# Altium project ESP32_EGG_INCUBATION.PrjPcb
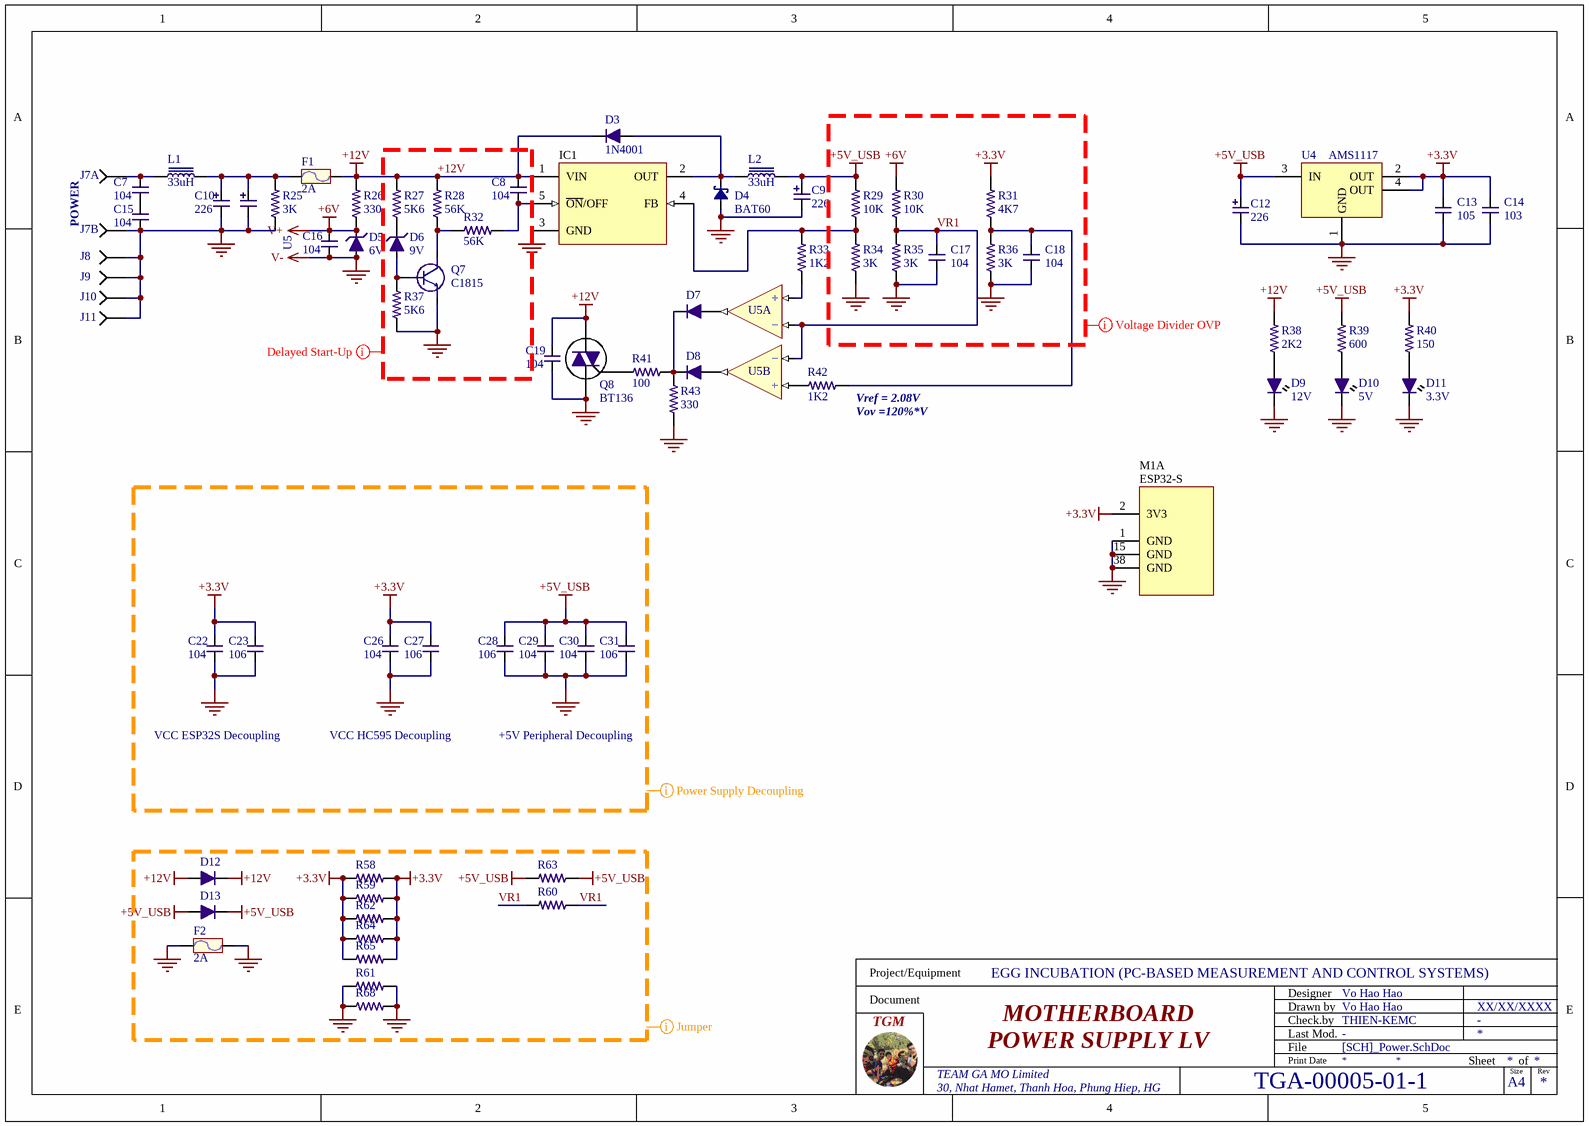
[diagram p0: [SCH]_Power.SchDoc]
4 sheets, 151 parts. Net scope: flat (ports and power ports of the same name join across sheets).
Board file: [PCB]_MotherBoard.PcbDoc
Sheets:
  [SCH]_Power.SchDoc
  [SCH]_MainProcessor.SchDoc
  [SCH]_IO.SchDoc
  [SCH]_HMI.SchDoc

## Sheet [SCH]_Power.SchDoc: MOTHERBOARD
size 297 x 209 mm; CheckedBy: THIEN-KEMC; CompanyName: TEAM GA MO; DrawnBy: Vo Hao Hao; Organization: TEAM GA MO; Address1: TEAM GA MO Limited; Address2: 30, Nhat Hamet, Thanh Hoa, Phung Hiep, HG; TGM_Number: TGA-00005-01-1; Projet: EGG INCUBATION (PC-BASED MEASUREMENT AND CONTROL SYSTEMS); ModifiedBy: -; CreateDate: XX/XX/XXXX; CheckedDate: -; Title2: POWER SUPPLY LV; DivGrp: TGM; Designer: Vo Hao Hao

### Parts
C7  104  [CAP-SMD-0805]
C8  104  [CAP-SMD-0805]
C9  226  [CAP-SMD-2512]
C10  226  [CAP-SMD-2512]
C11  226  [CAP-SMD-2512]  (value not drawn)
C12  226  [CAP-SMD-2512]
C13  105  [CAP-SMD-0805]
C14  103  [CAP-SMD-0805]
C15  104  [CAP-SMD-0805]
C16  104  [CAP-SMD-0805]
C17  104  [CAP-SMD-0805]
C18  104  [CAP-SMD-0805]
C19  104  [CAP-SMD-0805]
C22  104  [CAP-SMD-0805]
C23  106  [CAP-SMD-0805]
C26  104  [CAP-SMD-0805]
C27  106  [CAP-SMD-0805]
C28  106  [CAP-SMD-0805]
C29  104  [CAP-SMD-0805]
C30  104  [CAP-SMD-0805]
C31  106  [CAP-SMD-0805]
D3  1N4001  [DIO-SMD-123]
D4  BAT60  [DIO-SMD-106]
D5  6V  [DIO-SMD-123]
D6  9V  [DIO-SMD-123]
D7  1N4001  [DIO-SMD-123]  (value not drawn)
D8  1N4001  [DIO-SMD-123]  (value not drawn)
D9  12V  [LED0603-IPC]
D10  5V  [LED0603-IPC]
D11  3.3V  [LED0603-IPC]
D12  1N4001  [DIO-SMD-123]  (value not drawn)
D13  1N4001  [DIO-SMD-123]  (value not drawn)
F1  2A  [Fuse-SMD 1813]
F2  2A  [Fuse-SMD 1813]
IC1  LM2596  [TO263]  (value not drawn)
J7  POWER  [KF2/5.08]  (value not drawn)  (parts A,B of 2)
J8  MASS 3MM  [MY_PAD_3MM]  (value not drawn)
J9  MASS 3MM  [MY_PAD_3MM]  (value not drawn)
J10  MASS 3MM  [MY_PAD_3MM]  (value not drawn)
J11  MASS 3MM  [MY_PAD_3MM]  (value not drawn)
L1  33uH  [5026_INDUCTOR]
L2  33uH  [5026_INDUCTOR]
M1  ESP32-S  [ESP32-S-Footprint]  (part A of 4)
Q7  C1815  [SOT23(123)]
Q8  BT136  [TO252AA]
R25  value 3K  [RES-SMD-0805]  (hidden comment: R0805)
R26  value 330  [RES-SMD-0805]  (hidden comment: R0805)
R27  value 5K6  [RES-SMD-0805]  (hidden comment: R0805)
R28  value 56K  [RES-SMD-0805]  (hidden comment: R0805)
R29  value 10K  [RES-SMD-0805]  (hidden comment: R0805)
R30  value 10K  [RES-SMD-0805]  (hidden comment: R0805)
R31  value 4K7  [RES-SMD-0805]  (hidden comment: R0805)
R32  value 56K  [RES-SMD-0805]  (hidden comment: R0805)
R33  value 1K2  [RES-SMD-0805]  (hidden comment: R0805)
R34  value 3K  [RES-SMD-0805]  (hidden comment: R0805)
R35  value 3K  [RES-SMD-0805]  (hidden comment: R0805)
R36  value 3K  [RES-SMD-0805]  (hidden comment: R0805)
R37  value 5K6  [RES-SMD-0805]  (hidden comment: R0805)
R38  value 2K2  [RES-SMD-0805]  (hidden comment: R0805)
R39  value 600  [RES-SMD-0805]  (hidden comment: R0805)
R40  value 150  [RES-SMD-0805]  (hidden comment: R0805)
R41  value 100  [RES-SMD-0805]  (hidden comment: R0805)
R42  value 1K2  [RES-SMD-0805]  (hidden comment: R0805)
R43  value 330  [RES-SMD-0805]  (hidden comment: R0805)
R58  R0805  [RES-SMD-0805]  (value not drawn)
R59  R0805  [RES-SMD-0805]  (value not drawn)
R60  R0805  [RES-SMD-0805]  (value not drawn)
R61  R0805  [RES-SMD-0805]  (value not drawn)
R62  R0805  [RES-SMD-2512]  (value not drawn)
R63  R0805  [RES-SMD-2512]  (value not drawn)
R64  R0805  [RES-SMD-2512]  (value not drawn)
R65  R0805  [RES-SMD-2512]  (value not drawn)
R68  R0805  [RES-SMD-0805]  (value not drawn)
U4  AMS1117  [SOT223(1234)]
U5  LM358  [SOIC-8S]  (value not drawn)  (parts A,B of 2)

### Nets
+3.3V: C13.2 C14.2 C22.2 C23.2 C26.2 C27.2 M1.2(3V3) R31.2 R40.2 R58.1 R58.2 R59.1 R59.2 R62.1 R62.2 R64.1 R64.2 R65.1 R65.2 U4.2(OUT) U4.4(OUT)
+5V_USB: C9.1 C12.1 C28.2 C29.2 C30.2 C31.2 D13.1 D13.2 L2.2 R29.2 R39.2 R63.1 R63.2 U4.3(IN)
+6V: C16.2 D5.2 R26.1 R30.2 U5.8(V+)  [also labelled V+]
+12V: C8.2 C19.2 D3.2 D12.1 D12.2 F1.2 IC1.1(VIN) Q8.2(T2) R26.2 R27.2 R28.2 R38.2
GND: C9.2 C10.2 C11.2 C12.2 C13.1 C14.1 C15.1 C16.1 C17.1 C18.1 C19.1 C22.1 C23.1 C26.1 C27.1 C28.1 C29.1 C30.1 C31.1 D4.1 D5.1 D9.K D10.K D11.K F2.1 F2.2 IC1.3(GND) J7.2 J8.0 J9.0 J10.0 J11.0 M1.1(GND) M1.15(GND) M1.38(GND) Q7.3(E) Q8.1(T1) R25.1 R34.1 R35.1 R36.1 R37.1 R43.1 R61.1 R61.2 R68.1 R68.2 U4.1(GND) U5.4(V-)  [also labelled V-]
VR1: C17.2 R30.1 R35.2 R60.1 R60.2 U5.2(-IN) U5.6(-IN)
NetC7_1: C7.1 C15.2
NetC7_2: C7.2 J7.1 L1.1
NetC8_1: C8.1 IC1.5(~{ON}/OFF) R32.1
NetC10_1: C10.1 C11.1 F1.1 L1.2 R25.2
NetC18_2: C18.2 R31.1 R36.2 R42.1
NetD3_1: D3.1 D4.2 IC1.2(OUT) L2.1
NetD6_1: D6.1 Q7.1(B) R37.2
NetD6_2: D6.2 R27.1
NetD7_1: D7.1 U5.1(OUT)
NetD7_2: D7.2 D8.2 R41.2 R43.2
NetD8_1: D8.1 U5.7(OUT)
NetD9_A: D9.A R38.1
NetD10_A: D10.A R39.1
NetD11_A: D11.A R40.1
NetIC1_4: IC1.4(FB) R29.1 R33.2 R34.2
NetQ7_2: Q7.2(C) R28.1 R32.2
NetQ8_3: Q8.3(G) R41.1
NetR33_1: R33.1 U5.3(+IN)
NetR42_2: R42.2 U5.5(+IN)

### Layout directives
mark named Delayed Start-Up: +12V, GND
mark named Voltage Divider OVP: +3.3V, +5V_USB, +6V, GND, VR1
mark named Power Supply Decoupling: +3.3V, +5V_USB, GND
mark named Jumper: +3.3V, +5V_USB, +12V, GND, VR1

### Notes on the sheet
- (near J7) POWER
- U5
- (near R42) Vref = 2.08V
- (near R42) Vov =120%*V
- VCC ESP32S Decoupling
- VCC HC595 Decoupling
- +5V Peripheral Decoupling
- Project/Equipment
- Document
- Designer
- Drawn by
- Check.by
- File
- Last Mod.
- Print Date
- Sheet
- Size
- A4
- of
- Rev

### Library data of the parts
C7 C8 C13-C19 C22 C23 C26-C31 = Cap-Non-SMD: Non-polar capacitor
C9-C12 = Cap-Pol-SMD: Non-polar capacitor
D3 D7 D8 D12 D13 = 1N4001: 1.0A RECTIFIER; ComponentLink1Description: Datasheet; ComponentLink1URL: E:\NEW_DATA\ELECTRONIC_DOCUMENT\DATASHEET\1N4001 (2).pdf; Price: 0.006
D4 = BAT60: DIODE SCHOTTKY 10V 3A SOD323-2; Supplier 1: Digi-Key; Supplier Part Number 1: BAT60BE6327HTSA1CT-ND; Price: 0.008
D5 D6 = ZENER: DIODE-ZNR 5.1V 5% PD=1W IR=10uA; Manufacturer: Littlefuse Inc.; Manufacturer’s ordering code: SMF22A; Value: 24.4V; Part Number: SMF22A; Supplier 1: Digi-Key; Supplier 2: Mouser; Supplier Part Number 1: F5822CT-ND; Supplier Part Number 2: 576-SMF22A; Supplier 3: LCSC; Supplier Part Number 3: C169431
D9 = LED 0603 Red: LED RED CLEAR 0603 SMD VF 1.8; Supplier 1: Digi-Key; Supplier Part Number 1: 732-4979-1-ND
D10 = LED 0603 Yellow: LED YELLOW CLEAR 0603 SMD VF 1.85; Supplier 1: Digi-Key; Supplier Part Number 1: 732-4981-1-ND
D11 = LED 0603 Green: LED GREEN CLEAR 0603 SMD VF 2.5V; Supplier 1: Digi-Key; Supplier Part Number 1: 732-4971-1-ND
F1 F2 = Fuse SMD
IC1 = LM2596: Power IC; Max Input Voltage: 12 V; Max Output Current: 3 (6.0 peak) A; Max Output Voltage: mV; Category: IC-Power; Min Input Voltage: mV; Min Output Voltage: mV; Mounting Technology: Surface Mount; Status: Unreleased; Supply Voltage: mV; Temperature Range: -40 to +125 degC
J7 = JP2_IN
J8-J11 = JP1_IN: 3MM PAD
L1 L2 = INDUCTOR_FE: 2.2µH Shielded Wirewound Inductor 8.2A 10mOhm Max Nonstandard, 4 Lead; Supplier 1: Digi-Key; Supplier 2: Mouser; Supplier Part Number 1: 811-3603-1-ND; Supplier Part Number 2: 580-482R2SC; Value: 33uH
M1 = ESP32-S: Tensilica Xtensa LX6 microprocessor @ 160 or 240 MHz · 320 KiB SRAM; Bandwidth: 72 MHz; Data Rate: 150 Mbps; Interface: Ethernet, I2C, I2S, SPI, UART; Supply Voltage: 2.7 ~ 3.6 V; Number of ADC Channels: 16; Number of GPIO: 32; Nominal Supply Current: 500 mA; Number of cores: 2; Max CPU Freq: 240 MHz; CPU Name: ESP32-D0WDQ6; ComponentLink1Description: PCB; ComponentLink1URL: https://evertdekker.com/wp/?p=854; Temperature Range: -40 to +85 degC; Height: 3.2 mm
Q7 = NPN: Transistor, NPN, RF, 50mA, 12V; Supplier 1: Digi-Key; Supplier Part Number 1: 568-11514-1-ND
Q8 = SCR: THYRISTOR-TRIAC TO-220AB VRRM=600
R25-R43 = RES: Chip Resistor, 0805, 1%, 1/8 W; Supplier Part Number 1: 311-1.00KLRCT-ND; PackageReference: J1-0805; PackageDescription: Chip Resistor; Price: 0.005
R58-R61 R68 = RES: Chip Resistor, 0805, 1%, 1/8 W; Value: 0; Supplier Part Number 1: 311-1.00KLRCT-ND; PackageReference: J1-0805; PackageDescription: Chip Resistor; Price: 0.005
R62-R65 = RES: Chip Resistor, 0805, 1%, 1/8 W; Value: 1.0; Supplier Part Number 1: 311-1.00KLRCT-ND; PackageReference: J1-0805; PackageDescription: Chip Resistor; Price: 0.005
U4 = AMS1117: 1A Bipolar Linear Regulator; ComponentLink1Description: Datasheet; ComponentLink1URL: E:\NEW_DATA\ELECTRONIC_DOCUMENT\DATASHEET\AMS1117-1-2_C475600.pdf
U5 = LM358: 7mV 250nA 7uV/C 1MHz 0.6V/uS 0.8mA 3-32V; Price: 0.24

## Sheet [SCH]_MainProcessor.SchDoc: MOTHERBOARD
size 297 x 209 mm; CheckedBy: THIEN-KEMC; CompanyName: TEAM GA MO; DrawnBy: Vo Hao Hao; Organization: TEAM GA MO; Address1: TEAM GA MO Limited; Address2: 30, Nhat Hamet, Thanh Hoa, Phung Hiep, HG; TGM_Number: TGA-00005-02-1; Projet: EGG INCUBATION (PC-BASED MEASUREMENT AND CONTROL SYSTEMS); ModifiedBy: -; CreateDate: XX/XX/XXXX; CheckedDate: -; Title2: MAIN PROCESSOR ESP32; DivGrp: TGM; Designer: Vo Hao Hao
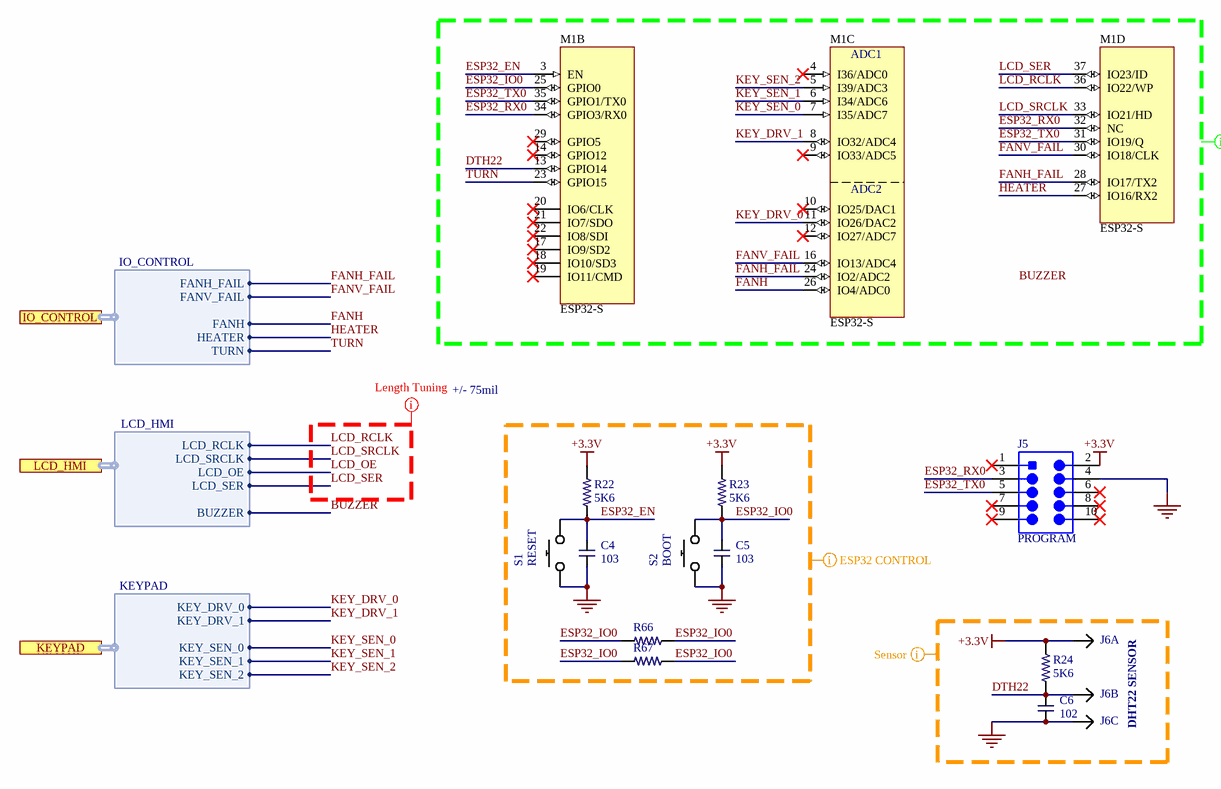
[diagram p1: [SCH]_MainProcessor.SchDoc]

### Parts
C4  103  [CAP-SMD-0805]
C5  103  [CAP-SMD-0805]
C6  102  [CAP-SMD-0805]
J5  PROGRAM  [IDC10]
J6  DHT22  [KF3/5.08]  (value not drawn)  (parts A,B,C of 3)
M1  ESP32-S  [ESP32-S-Footprint]  (parts B,C,D of 4)
R22  value 5K6  [RES-SMD-0805]  (hidden comment: R0805)
R23  value 5K6  [RES-SMD-0805]  (hidden comment: R0805)
R24  value 5K6  [RES-SMD-0805]  (hidden comment: R0805)
R66  R0805  [RES-SMD-0805]  (value not drawn)
R67  R0805  [RES-SMD-0805]  (value not drawn)
S1  RESET  [TL3342F260QG]
S2  BOOT  [TL3342F260QG]

### Ports
IO_CONTROL (harness IO_CONTROL), KEYPAD (harness KEYPAD), LCD_HMI (harness LCD_HMI)

### Harnesses
KEYPAD: KEY_SEN_0, KEY_SEN_1, KEY_SEN_2, KEY_DRV_0, KEY_DRV_1
IO_CONTROL: FANH_FAIL, FANV_FAIL, FANH, HEATER, TURN
LCD_HMI: LCD_RCLK, LCD_SRCLK, LCD_OE, LCD_SER, BUZZER

### Nets
+3.3V: J5.2 J6.1 R22.2 R23.2 R24.2
GND: C4.1 C5.1 C6.1 J5.4 J6.3 S1.1 S2.1
LCD_RCLK: M1.36(IO22/WP) ; port LCD_HMI.LCD_RCLK
LCD_SER: M1.37(IO23/ID) ; port LCD_HMI.LCD_SER
LCD_SRCLK: M1.33(IO21/HD) ; port LCD_HMI.LCD_SRCLK
DTH22: C6.2 J6.2 M1.13(GPIO14) R24.1
ESP32_EN: C4.2 M1.3(EN) R22.1 S1.2
ESP32_IO0: C5.2 M1.25(GPIO0) R23.1 R66.1 R66.2 R67.1 R67.2 S2.2
ESP32_RX0: J5.3 M1.32(NC) M1.34(GPIO3/RX0)
ESP32_TX0: J5.5 M1.31(IO19/Q) M1.35(GPIO1/TX0)
FANH: M1.26(IO4/ADC0) ; port IO_CONTROL.FANH
FANH_FAIL: M1.24(IO2/ADC2) M1.28(IO17/TX2) ; port IO_CONTROL.FANH_FAIL
FANV_FAIL: M1.16(IO13/ADC4) M1.30(IO18/CLK) ; port IO_CONTROL.FANV_FAIL
HEATER: M1.27(IO16/RX2) ; port IO_CONTROL.HEATER
KEY_DRV_0: M1.11(IO26/DAC2) ; port KEYPAD.KEY_DRV_0
KEY_DRV_1: M1.8(IO32/ADC4) ; port KEYPAD.KEY_DRV_1
KEY_SEN_0: M1.7(I35/ADC7) ; port KEYPAD.KEY_SEN_0
KEY_SEN_1: M1.6(I34/ADC6) ; port KEYPAD.KEY_SEN_1
KEY_SEN_2: M1.5(I39/ADC3) ; port KEYPAD.KEY_SEN_2
LCD_OE: port LCD_HMI.LCD_OE
TURN: M1.23(GPIO15) ; port IO_CONTROL.TURN

Not connected (* = marked no-connect by the designer): J5 1* 6* 7* 8* 9* 10*; M1 4(I36/ADC0)* 9(IO33/ADC5)* 10(IO25/DAC1)* 12(IO27/ADC7)* 14(GPIO12)* 17(IO9/SD2)* 18(IO10/SD3)* 19(IO11/CMD)* 20(IO6/CLK)* 21(IO7/SDO)* 22(IO8/SDI)* 29(GPIO5)*

### Layout directives
net class ADC_DATA - 150mil: LCD_OE, LCD_RCLK, LCD_SER, LCD_SRCLK
mark named Sensor: +3.3V, DTH22, GND
mark named ESP32 CONTROL: +3.3V, ESP32_EN, ESP32_IO0, GND
mark named MAIN PROCESSOR: BUZZER, DTH22, ESP32_EN, ESP32_IO0, ESP32_RX0, ESP32_TX0, FANH, FANH_FAIL, FANV_FAIL, HEATER, KEY_DRV_0, KEY_DRV_1, KEY_SEN_0, KEY_SEN_1, KEY_SEN_2, LCD_RCLK, LCD_SER, LCD_SRCLK, TURN

### Notes on the sheet
- +/- 75mil
- (near J6) DHT22 SENSOR
- Labels drawn without touching a wire or pin: BUZZER
- Project/Equipment
- Document
- Designer
- Drawn by
- Check.by
- File
- Last Mod.
- Print Date
- Sheet
- Size
- A4
- of
- Rev
- (in symbol ESP32-S, part C) ADC1; ADC2

### Library data of the parts
C4-C6 = Cap-Non-SMD: Non-polar capacitor
J5 = IDE_5X2: Male Box Header WR-BHD, THT, Vertical, pitch 2.54 mm, 10 pins
J6 = JP3
M1 = ESP32-S: as M1 on sheet [SCH]_Power; ComponentLink1Description: PCB; ComponentLink1URL: https://evertdekker.com/wp/?p=854; Temperature Range: -40 to +85 degC; Height: 3.2 mm
R22-R24 = RES: Chip Resistor, 0805, 1%, 1/8 W; Supplier Part Number 1: 311-1.00KLRCT-ND; PackageReference: J1-0805; PackageDescription: Chip Resistor; Price: 0.005
R66 R67 = RES: Chip Resistor, 0805, 1%, 1/8 W; Value: 0; Supplier Part Number 1: 311-1.00KLRCT-ND; PackageReference: J1-0805; PackageDescription: Chip Resistor; Price: 0.005
S1 S2 = SWITCH TACTILE SPST: SWITCH TACTILE SPST-NO 0.05A 12V; Manufacturer Part Number: TL3342F260QG; Supplier 1: Digi-Key; Supplier Part Number 1: EG5470CT-ND; Price: 0.25

## Sheet [SCH]_IO.SchDoc: MOTHERBOARD
size 297 x 209 mm; CheckedBy: THIEN-KEMC; CompanyName: TEAM GA MO; DrawnBy: Vo Hao Hao; Organization: TEAM GA MO; Address1: TEAM GA MO Limited; Address2: 30, Nhat Hamet, Thanh Hoa, Phung Hiep, HG; TGM_Number: TGA-00005-03-1; Projet: EGG INCUBATION (PC-BASED MEASUREMENT AND CONTROL SYSTEMS); ModifiedBy: -; CreateDate: XX/XX/XXXX; CheckedDate: -; Title2: INPUT/OUTPUT; DivGrp: TGM; Designer: Vo Hao Hao
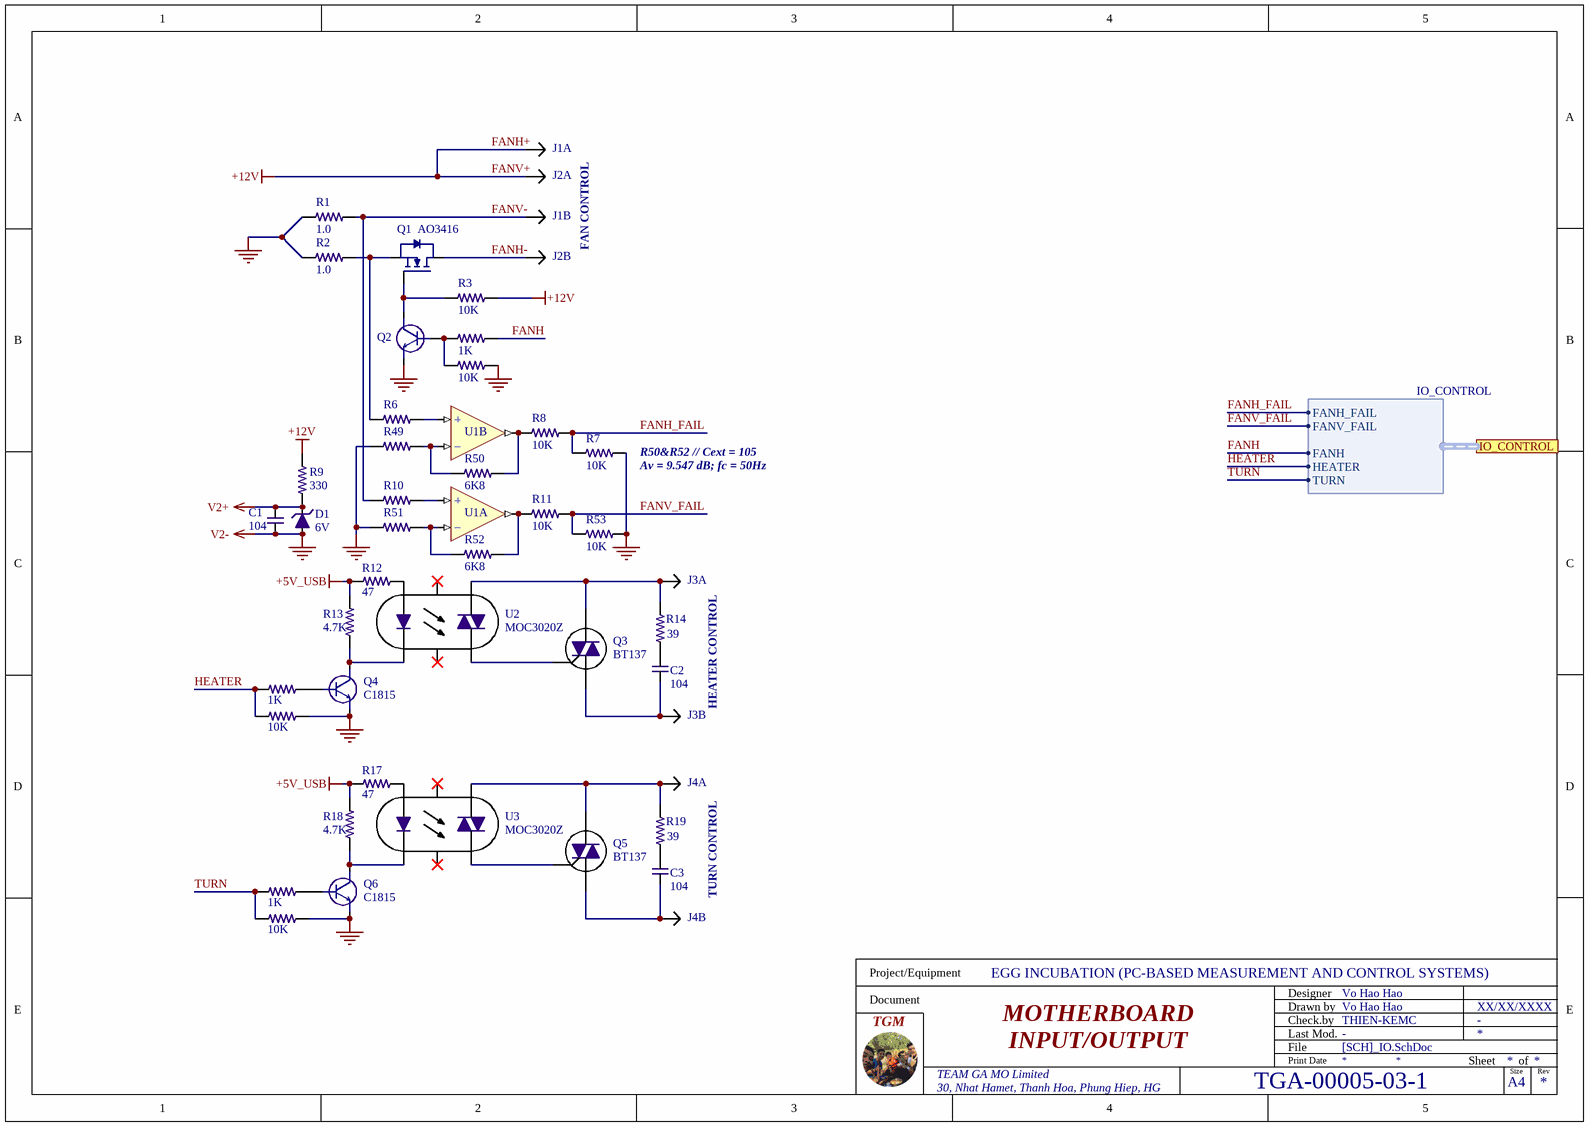
[diagram p2: [SCH]_IO.SchDoc]

### Parts
C1  104  [CAP-SMD-0805]
C2  104  [Cap-Mica-10-6.2x12.5x10.5]
C3  104  [Cap-Mica-10-6.2x12.5x10.5]
D1  6V  [DIO-SMD-123]
J1  FAN-HUMI  [KF2/5.08]  (value not drawn)  (parts A,B of 2)
J2  FAN-VENT  [KF2/5.08]  (value not drawn)  (parts A,B of 2)
J3  HEATER  [KF2/5.08]  (value not drawn)  (parts A,B of 2)
J4  TURN  [KF2/5.08]  (value not drawn)  (parts A,B of 2)
Q1  AO3416  [SOT23(123)]
Q2  NPN  [SOT23(123)]  (value not drawn)
Q3  BT137  [TO252AA]
Q4  C1815  [SOT23(123)]
Q5  BT137  [TO252AA]
Q6  C1815  [SOT23(123)]
R1  value 1.0  [RES-SMD-2512]  (hidden comment: RES-2512-4.7R)
R2  value 1.0  [RES-SMD-2512]  (hidden comment: RES-2512-4.7R)
R3  value 10K  [RES-SMD-0805]  (hidden comment: RES-2512-4.7R)
R4  value 1K  [RES-SMD-0805]  (hidden comment: RES-2512-4.7R)
R5  value 10K  [RES-SMD-0805]  (hidden comment: RES-2512-4.7R)
R6  RES-2512-4.7R  [RES-SMD-0805]  (value not drawn)
R7  value 10K  [RES-SMD-0805]  (hidden comment: RES-2512-4.7R)
R8  value 10K  [RES-SMD-0805]  (hidden comment: RES-2512-4.7R)
R9  value 330  [RES-SMD-0805]  (hidden comment: R0805)
R10  RES-2512-4.7R  [RES-SMD-0805]  (value not drawn)
R11  value 10K  [RES-SMD-0805]  (hidden comment: RES-2512-4.7R)
R12  value 47  [RES-SMD-0805]  (hidden comment: RES-2512-4.7R)
R13  value 4.7K  [RES-SMD-0805]  (hidden comment: RES-2512-4.7R)
R14  value 39  [RES-SMD-2512]  (hidden comment: RES)
R15  value 1K  [RES-SMD-0805]  (hidden comment: RES-2512-4.7R)
R16  value 10K  [RES-SMD-0805]  (hidden comment: RES-2512-4.7R)
R17  value 47  [RES-SMD-0805]  (hidden comment: RES-2512-4.7R)
R18  value 4.7K  [RES-SMD-0805]  (hidden comment: RES-2512-4.7R)
R19  value 39  [RES-SMD-2512]  (hidden comment: RES)
R20  value 1K  [RES-SMD-0805]  (hidden comment: RES-2512-4.7R)
R21  value 10K  [RES-SMD-0805]  (hidden comment: RES-2512-4.7R)
R49  RES-2512-4.7R  [RES-SMD-0805]  (value not drawn)
R50  value 6K8  [RES-SMD-0805]  (hidden comment: RES-2512-4.7R)
R51  RES-2512-4.7R  [RES-SMD-0805]  (value not drawn)
R52  value 6K8  [RES-SMD-0805]  (hidden comment: RES-2512-4.7R)
R53  value 10K  [RES-SMD-0805]  (hidden comment: RES-2512-4.7R)
U1  LM358  [SOIC-8S]  (value not drawn)  (parts A,B of 2)
U2  MOC3020Z  [DIP6]
U3  MOC3020Z  [DIP6]

### Ports
IO_CONTROL (harness IO_CONTROL)

### Harnesses
IO_CONTROL: FANH_FAIL, FANV_FAIL, FANH, HEATER, TURN

### Nets
+5V_USB: R12.2 R13.1 R17.2 R18.1
+12V: J1.1 J2.1 R3.2 R9.2  [also labelled FANH+, FANV+]
GND: C1.1 D1.1 Q2.3(E) Q4.3(E) Q6.3(E) R1.1 R2.1 R5.2 R7.2 R16.2 R21.2 R49.1 R51.1 R53.2 U1.4(V-)  [also labelled V2-]
V2+: C1.2 D1.2 R9.1 U1.8(V+)
FANH: R4.2 ; port IO_CONTROL.FANH
FANH-: J2.2 Q1.2(D)
FANH_FAIL: R7.1 R8.2 ; port IO_CONTROL.FANH_FAIL
FANV-: J1.2 R1.2 R10.1
FANV_FAIL: R11.2 R53.1 ; port IO_CONTROL.FANV_FAIL
HEATER: R15.1 R16.1 ; port IO_CONTROL.HEATER
TURN: R20.1 R21.1 ; port IO_CONTROL.TURN
NetC2_1: C2.1 J3.2 Q3.1(T1)
NetC2_2: C2.2 R14.1
NetC3_1: C3.1 J4.2 Q5.1(T1)
NetC3_2: C3.2 R19.1
NetJ3_1: J3.1 Q3.2(T2) R14.2 U2.6
NetJ4_1: J4.1 Q5.2(T2) R19.2 U3.6
NetQ1_1: Q1.1(G) Q2.2(C) R3.1
NetQ1_3: Q1.3(S) R2.2 R6.1
NetQ2_1: Q2.1(B) R4.1 R5.1
NetQ3_3: Q3.3(G) U2.4
NetQ4_1: Q4.1(B) R15.2
NetQ4_2: Q4.2(C) R13.2 U2.2
NetQ5_3: Q5.3(G) U3.4
NetQ6_1: Q6.1(B) R20.2
NetQ6_2: Q6.2(C) R18.2 U3.2
NetR6_2: R6.2 U1.5(+IN)
NetR8_1: R8.1 R50.2 U1.7(OUT)
NetR10_2: R10.2 U1.3(+IN)
NetR11_1: R11.1 R52.2 U1.1(OUT)
NetR12_1: R12.1 U2.1
NetR17_1: R17.1 U3.1
NetR49_2: R49.2 R50.1 U1.6(-IN)
NetR51_2: R51.2 R52.1 U1.2(-IN)

Not connected (* = marked no-connect by the designer): U2 3* 5*; U3 3* 5*

### Notes on the sheet
- FAN CONTROL
- (near R7) R50&R52 // Cext = 105
- (near R7) Av = 9.547 dB; fc = 50Hz
- (near J3) HEATER CONTROL
- TURN CONTROL
- Project/Equipment
- Document
- Designer
- Drawn by
- Check.by
- File
- Last Mod.
- Print Date
- Sheet
- Size
- A4
- of
- Rev

### Library data of the parts
C1 = Cap-Non-SMD: Non-polar capacitor
C2 C3 = Cap-Non-DIP: Non-polar capacitor; Price: 0.005
D1 = ZENER: as D5 on sheet [SCH]_Power; Part Number: SMF22A; Supplier 1: Digi-Key; Supplier 2: Mouser; Supplier Part Number 1: F5822CT-ND; Supplier Part Number 2: 576-SMF22A; Supplier 3: LCSC; Supplier Part Number 3: C169431
J1-J4 = JP2
Q1 = IRFR3910TRLPBF: N-Channel 16A (Tc) 79W (Tc) Surface Mount D-Pak; Supplier 1: Digi-Key; Supplier 2: Mouser; Supplier 3: LCSC; Supplier Part Number 1: IRFR3910TRLPBFCT-ND; Supplier Part Number 2: 942-IRFR3910TRLPBF; Supplier Part Number 3: C148158; Price: 0.15
Q2 Q4 Q6 = NPN: Transistor, NPN, RF, 50mA, 12V; Supplier 1: Digi-Key; Supplier Part Number 1: 568-11514-1-ND
Q3 Q5 = SCR: THYRISTOR-TRIAC TO-220AB VRRM=600
R1-R5 R7-R9 R11-R21 R50 R52 R53 = RES: Chip Resistor, 0805, 1%, 1/8 W; PackageReference: J1-0805; PackageDescription: Chip Resistor; Supplier Part Number 1: 311-1.00KLRCT-ND; Price: 0.005
R6 R10 R49 R51 = RES: Chip Resistor, 0805, 1%, 1/8 W; Value: 1K; PackageReference: J1-0805; PackageDescription: Chip Resistor; Supplier Part Number 1: 311-1.00KLRCT-ND; Price: 0.005
U1 = LM358: 7mV 250nA 7uV/C 1MHz 0.6V/uS 0.8mA 3-32V; Price: 0.24
U2 U3 = MOC3020Z: OPTO-ISOLATOR LED-PTRIAC IF=50mA-max

## Sheet [SCH]_HMI.SchDoc: MOTHERBOARD
size 297 x 209 mm; CheckedBy: THIEN-KEMC; CompanyName: TEAM GA MO; DrawnBy: Vo Hao Hao; Organization: TEAM GA MO; Address1: TEAM GA MO Limited; Address2: 30, Nhat Hamet, Thanh Hoa, Phung Hiep, HG; TGM_Number: TGA-00005-04-1; Projet: EGG INCUBATION (PC-BASED MEASUREMENT AND CONTROL SYSTEMS); ModifiedBy: -; CreateDate: XX/XX/XXXX; CheckedDate: -; Title2: INPUT/OUTPUT; DivGrp: TGM; Designer: Vo Hao Hao
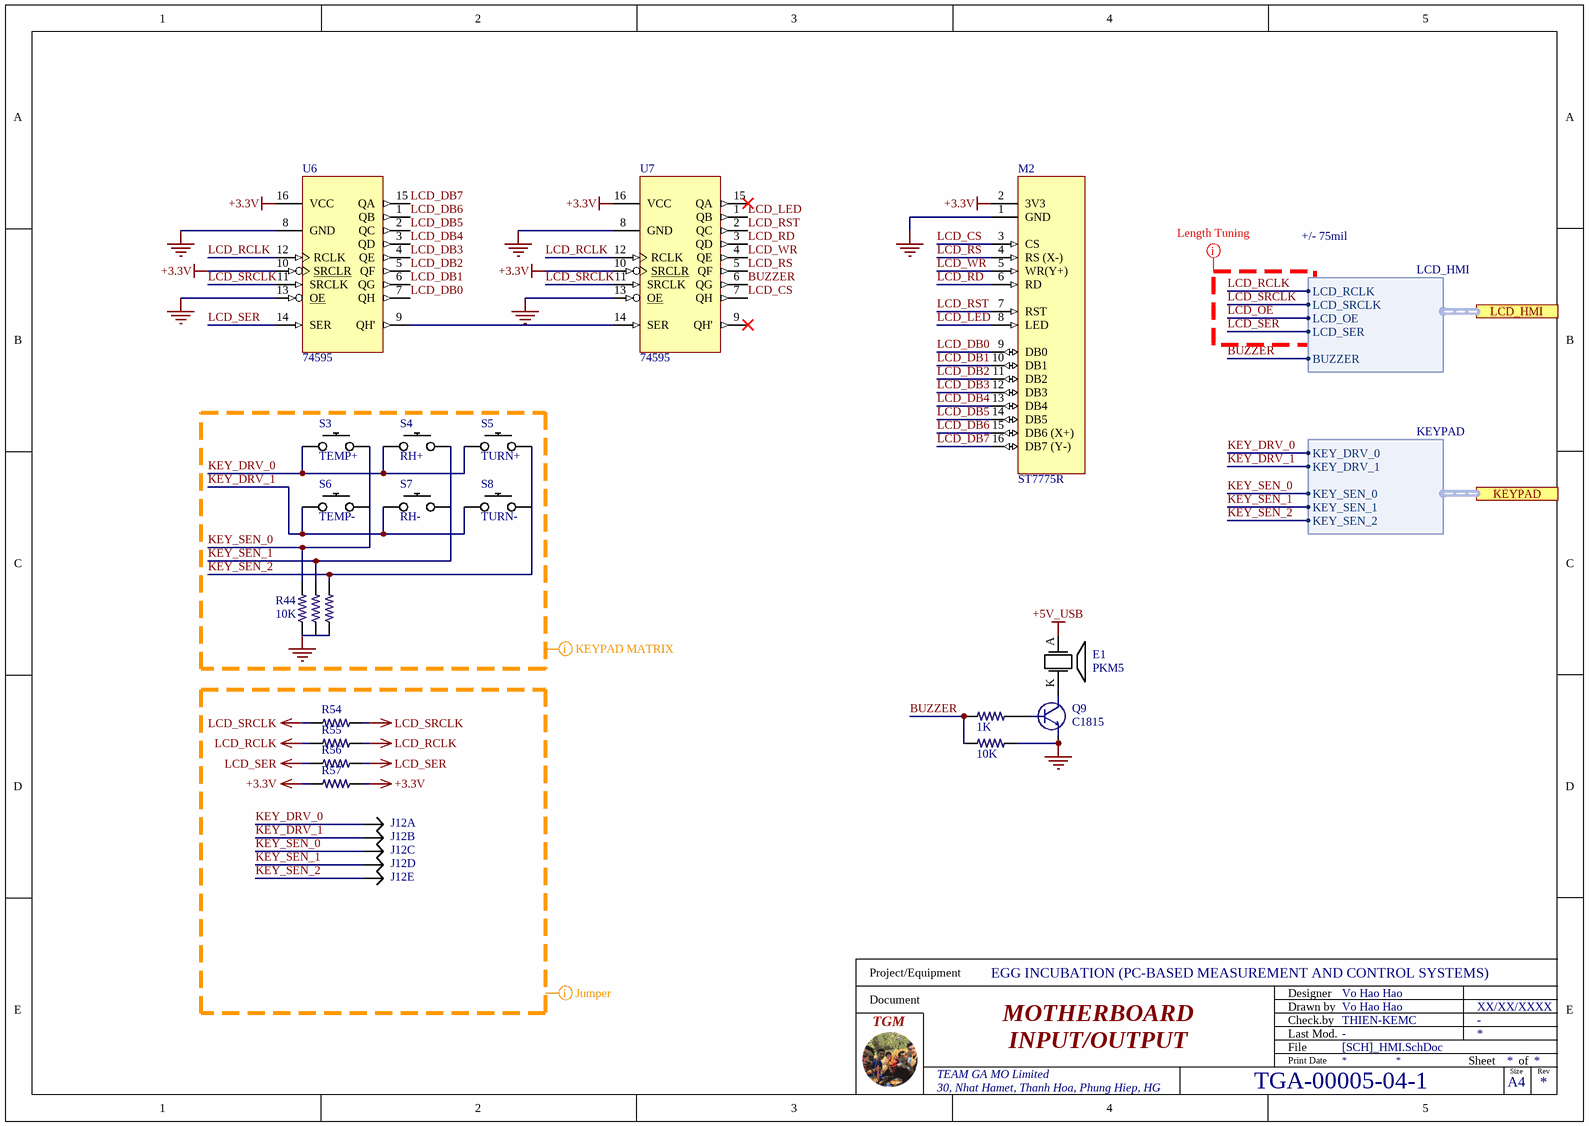
[diagram p3: [SCH]_HMI.SchDoc]

### Parts
E1  PKM5  [BUZZER]
J12  KEYPAD  [Header 5P]  (value not drawn)  (parts A,B,C,D,E of 5)
M2  ST7775R  [LCD_176X220_MODULE]
Q9  C1815  [SOT23(123)]
R44  value 10K  [RES-SMD-0805]  (hidden comment: RES-2512-4.7R)  (graphical)
R45  RES-2512-4.7R  [RES-SMD-0805]  (value not drawn)  (graphical)
R46  RES-2512-4.7R  [RES-SMD-0805]  (value not drawn)  (graphical)
R47  value 1K  [RES-SMD-0805]  (hidden comment: RES-2512-4.7R)
R48  value 10K  [RES-SMD-0805]  (hidden comment: RES-2512-4.7R)
R54  R0805  [RES-SMD-0805]  (value not drawn)
R55  R0805  [RES-SMD-0805]  (value not drawn)
R56  R0805  [RES-SMD-0805]  (value not drawn)
R57  R0805  [RES-SMD-0805]  (value not drawn)
S3  TEMP+  [Header 2P]  (graphical)
S4  RH+  [Header 2P]  (graphical)
S5  TURN+  [Header 2P]  (graphical)
S6  TEMP-  [Header 2P]  (graphical)
S7  RH-  [Header 2P]  (graphical)
S8  TURN-  [Header 2P]  (graphical)
U6  74595  [SOIC-16S]
U7  74595  [SOIC-16S]

### Ports
KEYPAD (harness KEYPAD), LCD_HMI (harness LCD_HMI)

### Harnesses
LCD_HMI: LCD_RCLK, LCD_SRCLK, LCD_OE, LCD_SER, BUZZER
KEYPAD: KEY_SEN_0, KEY_SEN_1, KEY_SEN_2, KEY_DRV_0, KEY_DRV_1

### Nets
+3.3V: M2.2(3V3) R57.1 R57.2 U6.10(SRCLR) U6.16(VCC) U7.10(SRCLR) U7.16(VCC)
+5V_USB: E1.A
GND: M2.1(GND) Q9.3(E) R44.2 R45.2 R46.2 R48.2 U6.8(GND) U6.13(OE) U7.8(GND) U7.13(OE)
LCD_RCLK: R55.1 R55.2 U6.12(RCLK) U7.12(RCLK) ; port LCD_HMI.LCD_RCLK
LCD_SER: R56.1 R56.2 U6.14(SER) ; port LCD_HMI.LCD_SER
LCD_SRCLK: R54.1 R54.2 U6.11(SRCLK) U7.11(SRCLK) ; port LCD_HMI.LCD_SRCLK
BUZZER: R47.1 R48.1 U7.6(QG) ; port LCD_HMI.BUZZER
KEY_DRV_0: J12.1 S3.1 S4.1 S5.1 ; port KEYPAD.KEY_DRV_0
KEY_DRV_1: J12.2 S6.1 S7.1 S8.1 ; port KEYPAD.KEY_DRV_1
KEY_SEN_0: J12.3 R44.1 S3.1 S6.1 ; port KEYPAD.KEY_SEN_0
KEY_SEN_1: J12.4 R45.1 S4.1 S7.1 ; port KEYPAD.KEY_SEN_1
KEY_SEN_2: J12.5 R46.1 S5.1 S8.1 ; port KEYPAD.KEY_SEN_2
LCD_CS: M2.3(CS) U7.7(QH)
LCD_DB0: M2.9(DB0) U6.7(QH)
LCD_DB1: M2.10(DB1) U6.6(QG)
LCD_DB2: M2.11(DB2) U6.5(QF)
LCD_DB3: M2.12(DB3) U6.4(QE)
LCD_DB4: M2.13(DB4) U6.3(QD)
LCD_DB5: M2.14(DB5) U6.2(QC)
LCD_DB6: M2.15(DB6_(X+)) U6.1(QB)
LCD_DB7: M2.16(DB7_(Y-)) U6.15(QA)
LCD_LED: M2.8(LED) U7.1(QB)
LCD_OE: port LCD_HMI.LCD_OE
LCD_RD: M2.6(RD) U7.3(QD)
LCD_RS: M2.4(RS_(X-)) U7.5(QF)
LCD_RST: M2.7(RST) U7.2(QC)
LCD_WR: M2.5(WR(Y+)) U7.4(QE)
NetE1_K: E1.K Q9.2(C)
NetQ9_1: Q9.1(B) R47.2
NetU6_9: U6.9(QH') U7.14(SER)

Not connected (* = marked no-connect by the designer): U7 9(QH')* 15(QA)*

### Layout directives
net class ADC_DATA - 150mil: LCD_OE, LCD_RCLK, LCD_SER, LCD_SRCLK
mark named KEYPAD MATRIX: GND, KEY_DRV_0, KEY_DRV_1, KEY_SEN_0, KEY_SEN_1, KEY_SEN_2
mark named Jumper: +3.3V, KEY_DRV_0, KEY_DRV_1, KEY_SEN_0, KEY_SEN_1, KEY_SEN_2, LCD_RCLK, LCD_SER, LCD_SRCLK

### Notes on the sheet
- +/- 75mil
- Project/Equipment
- Document
- Designer
- Drawn by
- Check.by
- File
- Last Mod.
- Print Date
- Sheet
- Size
- A4
- of
- Rev

### Library data of the parts
E1 = BUZZER: ALARM-AUDIBLE PIEZO ALARM PIN TYPE; 5V
J12 = JP5
M2 = LCD_176x220: ComponentLink1Description: Wiki; ComponentLink1URL: http://www.lcdwiki.com/2.8inch_SPI_Module_ILI9341_SKU:MSP2807
Q9 = NPN: Transistor, NPN, RF, 50mA, 12V; Supplier 1: Digi-Key; Supplier Part Number 1: 568-11514-1-ND
R44 R47 R48 = RES: Chip Resistor, 0805, 1%, 1/8 W; PackageReference: J1-0805; PackageDescription: Chip Resistor; Supplier Part Number 1: 311-1.00KLRCT-ND; Price: 0.005
R45 R46 = RES: Chip Resistor, 0805, 1%, 1/8 W; Value: 10K; PackageReference: J1-0805; PackageDescription: Chip Resistor; Supplier Part Number 1: 311-1.00KLRCT-ND; Price: 0.005
R54-R57 = RES: Chip Resistor, 0805, 1%, 1/8 W; Value: 0; Supplier Part Number 1: 311-1.00KLRCT-ND; PackageReference: J1-0805; PackageDescription: Chip Resistor; Price: 0.005
S3-S8 = SWITCH TACTILE SPST: SWITCH TACTILE SPST-NO 0.05A 12V; Manufacturer Part Number: TL3342F260QG; Supplier 1: Digi-Key; Supplier Part Number 1: EG5470CT-ND
U6 U7 = 74595: CD74HC595 8-Bit Shift Registers With 3-State Output Registers

## Nets that join several sheets
+3.3V: [SCH]_Power (21 pins), [SCH]_MainProcessor (5 pins), [SCH]_HMI (7 pins)
+5V_USB: [SCH]_Power (14 pins), [SCH]_IO (R12.2 R13.1 R17.2 R18.1), [SCH]_HMI (E1.A)
+12V: [SCH]_Power (12 pins), [SCH]_IO (J1.1 J2.1 R3.2 R9.2)
GND: [SCH]_Power (49 pins), [SCH]_MainProcessor (7 pins), [SCH]_IO (15 pins), [SCH]_HMI (10 pins)
LCD_RCLK: [SCH]_MainProcessor (M1.36), [SCH]_HMI (R55.1 R55.2 U6.12 U7.12)
LCD_SER: [SCH]_MainProcessor (M1.37), [SCH]_HMI (R56.1 R56.2 U6.14)
LCD_SRCLK: [SCH]_MainProcessor (M1.33), [SCH]_HMI (R54.1 R54.2 U6.11 U7.11)
FANH: [SCH]_MainProcessor (M1.26), [SCH]_IO (R4.2)
FANH_FAIL: [SCH]_MainProcessor (M1.24 M1.28), [SCH]_IO (R7.1 R8.2)
FANV_FAIL: [SCH]_MainProcessor (M1.16 M1.30), [SCH]_IO (R11.2 R53.1)
HEATER: [SCH]_MainProcessor (M1.27), [SCH]_IO (R15.1 R16.1)
KEY_DRV_0: [SCH]_MainProcessor (M1.11), [SCH]_HMI (J12.1 S3.1 S4.1 S5.1)
KEY_DRV_1: [SCH]_MainProcessor (M1.8), [SCH]_HMI (J12.2 S6.1 S7.1 S8.1)
KEY_SEN_0: [SCH]_MainProcessor (M1.7), [SCH]_HMI (J12.3 R44.1 S3.1 S6.1)
KEY_SEN_1: [SCH]_MainProcessor (M1.6), [SCH]_HMI (J12.4 R45.1 S4.1 S7.1)
KEY_SEN_2: [SCH]_MainProcessor (M1.5), [SCH]_HMI (J12.5 R46.1 S5.1 S8.1)
TURN: [SCH]_MainProcessor (M1.23), [SCH]_IO (R20.1 R21.1)